# Altium schematic sheet XIAO-HAT-3.SchDoc
size A4
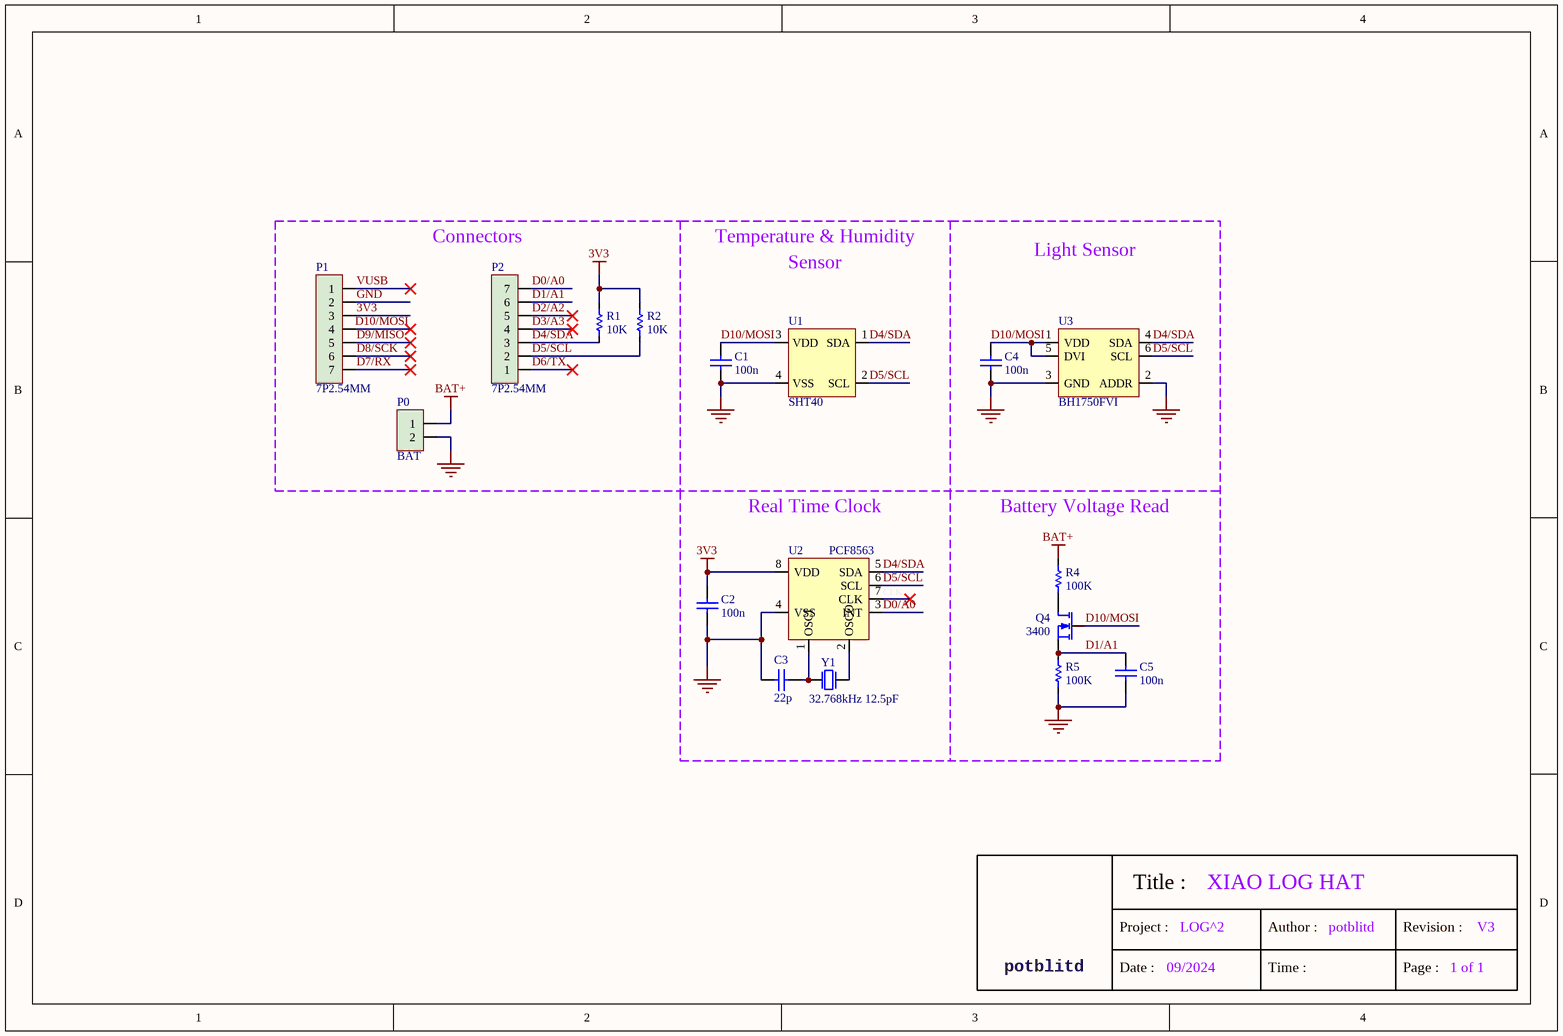
[diagram p0: XIAO-HAT-3.SchDoc]

## Parts
C1  value 100n  [XIAO-HAT_0603C-BOX]  (hidden comment: Capacitor)
C2  value 100n  [XIAO-HAT_0603C-BOX]  (hidden comment: Capacitor)
C3  value 22p  [XIAO-HAT_0603C-BOX]  (hidden comment: Capacitor)
C4  value 100n  [XIAO-HAT_0603C-BOX]  (hidden comment: Capacitor)
C5  value 100n  [XIAO-HAT_0603C-BOX]  (hidden comment: Capacitor)
P0  BAT  [2P-2.54mm-NOSILK]
P1  7P2.54MM  [7P-2.54mm-XIAO]
P2  7P2.54MM  [7P-2.54mm-XIAO]
Q4  3400  [XIAO-HAT_SOT23-3]
R1  value 10K  [XIAO-HAT_0603R-BOX]  (hidden comment: Resistor)
R2  value 10K  [XIAO-HAT_0603R-BOX]  (hidden comment: Resistor)
R4  value 100K  [XIAO-HAT_0603R-BOX]  (hidden comment: Resistor)
R5  value 100K  [XIAO-HAT_0603R-BOX]  (hidden comment: Resistor)
U1  SHT40  [XIAO-HAT_SHT40]
U2  PCF8563  [XIAO-HAT_SOP-8]
U3  BH1750FVI  [XIAO-HAT_BH1750]
Y1  value 32.768kHz 12.5pF  [XIAO-HAT_FC135]  (hidden comment: Oscillator)

## Nets
3V3: C2.1 P1.3 R1.2 R2.2 U2.8(VDD)
BAT+: P0.1 R4.2
GND: C1.2 C2.2 C3.2 C4.2 C5.2 P0.2 P1.2 R5.1 U1.4(VSS) U2.4(VSS) U3.2(ADDR) U3.3(GND)
CLK: U2.7(CLK)
D0/A0: P2.7 U2.3(INT)
D1/A1: C5.1 P2.6 Q4.2(S) R5.2
D2/A2: P2.5
D3/A3: P2.4
D4/SDA: P2.3 R1.1 U1.1(SDA) U2.5(SDA) U3.4(SDA)
D5/SCL: P2.2 R2.1 U1.2(SCL) U2.6(SCL) U3.6(SCL)
D6/TX: P2.1
D7/RX: P1.7
D8/SCK: P1.6
D9/MISO: P1.5
D10/MOSI: C1.1 C4.1 P1.4 Q4.1(G) U1.3(VDD) U3.1(VDD) U3.5(DVI)
VUSB: P1.1
NetC3_1: C3.1 U2.1(OSCI) Y1.2
NetQ4_3: Q4.3(D) R4.1
NetU2_2: U2.2(OSCO) Y1.1

## Notes on the sheet
- (near P2) Connectors
- Temperature & Humidity
- Sensor
- Light Sensor
- Real Time Clock
- (near R4) Battery Voltage Read
- Title :
- XIAO LOG HAT
- potblitd
- Project :
- Date :
- 09/2024
- LOG^2
- Author :
- Time :
- Revision :
- Page :
- 1 of 1
- V3

## Library data of the parts
C1 C2 C4 C5 = Capacitor: Capacitor 100nF ±10% 50V; Manufacturer: Samsung; Component: CL10B104KB8NNNC; Function: Decoupling; Package: 0603
C3 = Capacitor: Capacitor 22pF ±5% 50V; Manufacturer: Samsung; Component: CL10C220JB8NNNC; Function: XO Cap; Package: 0603
P0 = 2-pins Header: General 2-pin connection; Component: none; Function: BAT CON; Value: 2.54mm 1x2P
P1 P2 = 7-pins Header: General 7-pin connection; Component: none; Function: XIAO CON; Value: 2.54mm 1x7P
Q4 = MOSFET-N: MOSFET N-channel 30V 5.7A; Manufacturer: UMW(友台半导体); Component: AO3400A; Function: VBAT-ADC EN; Value: N-FET; Package: SOT23-3
R1 = Resistor: Resistor 10kΩ ±1% 1/16W; Manufacturer: UNI-ROYAL(厚声); Component: 0603WAF1002T5E; Function: SDA pull-up; Package: 0603
R2 = Resistor: Resistor 10kΩ ±1% 1/16W; Manufacturer: UNI-ROYAL(厚声); Component: 0603WAF1002T5E; Function: SCL pull-up; Package: 0603
R4 R5 = Resistor: Resistor 100kΩ ±1% 100mW; Manufacturer: UNI-ROYAL(厚声); Component: 0603WAF1003T5E; Function: VBAT DIV; Package: 0603
U1 = SHT40: SHT40 temperature and humidity sensor; Manufacturer: Sensirion(瑞士盛思锐); Component: SHT40-AD1B-R2; Function: T&H sensor; Value: I2C; Package: DFN_1.5x1.5MM
U2 = RTC-8563: IC real-time clock with alarm interrupt; Manufacturer: NXP; Component: PCF8563T/5,518; Function: RTC; Value: I2C; Package: SOIC8_150MIL
U3 = BH1750: Digital light sensor; Manufacturer: ROHM; Component: BH1750FVI-TR; Value: I2C; Function: light sensor; Package: WSOF6_1.6X1.6MM
Y1 = XO-2: Crystal oscillator 32.768kHz 20ppm 12.5pF; Manufacturer: TKD; Component: SF32K32768D31T-12.5; Function: RTC XO; Package: SMD3215_2P